# Altium schematic sheet M.2-12V-LED-Regulator-Relay-copy_2024-05-01.schdoc
size 290 x 293 mm
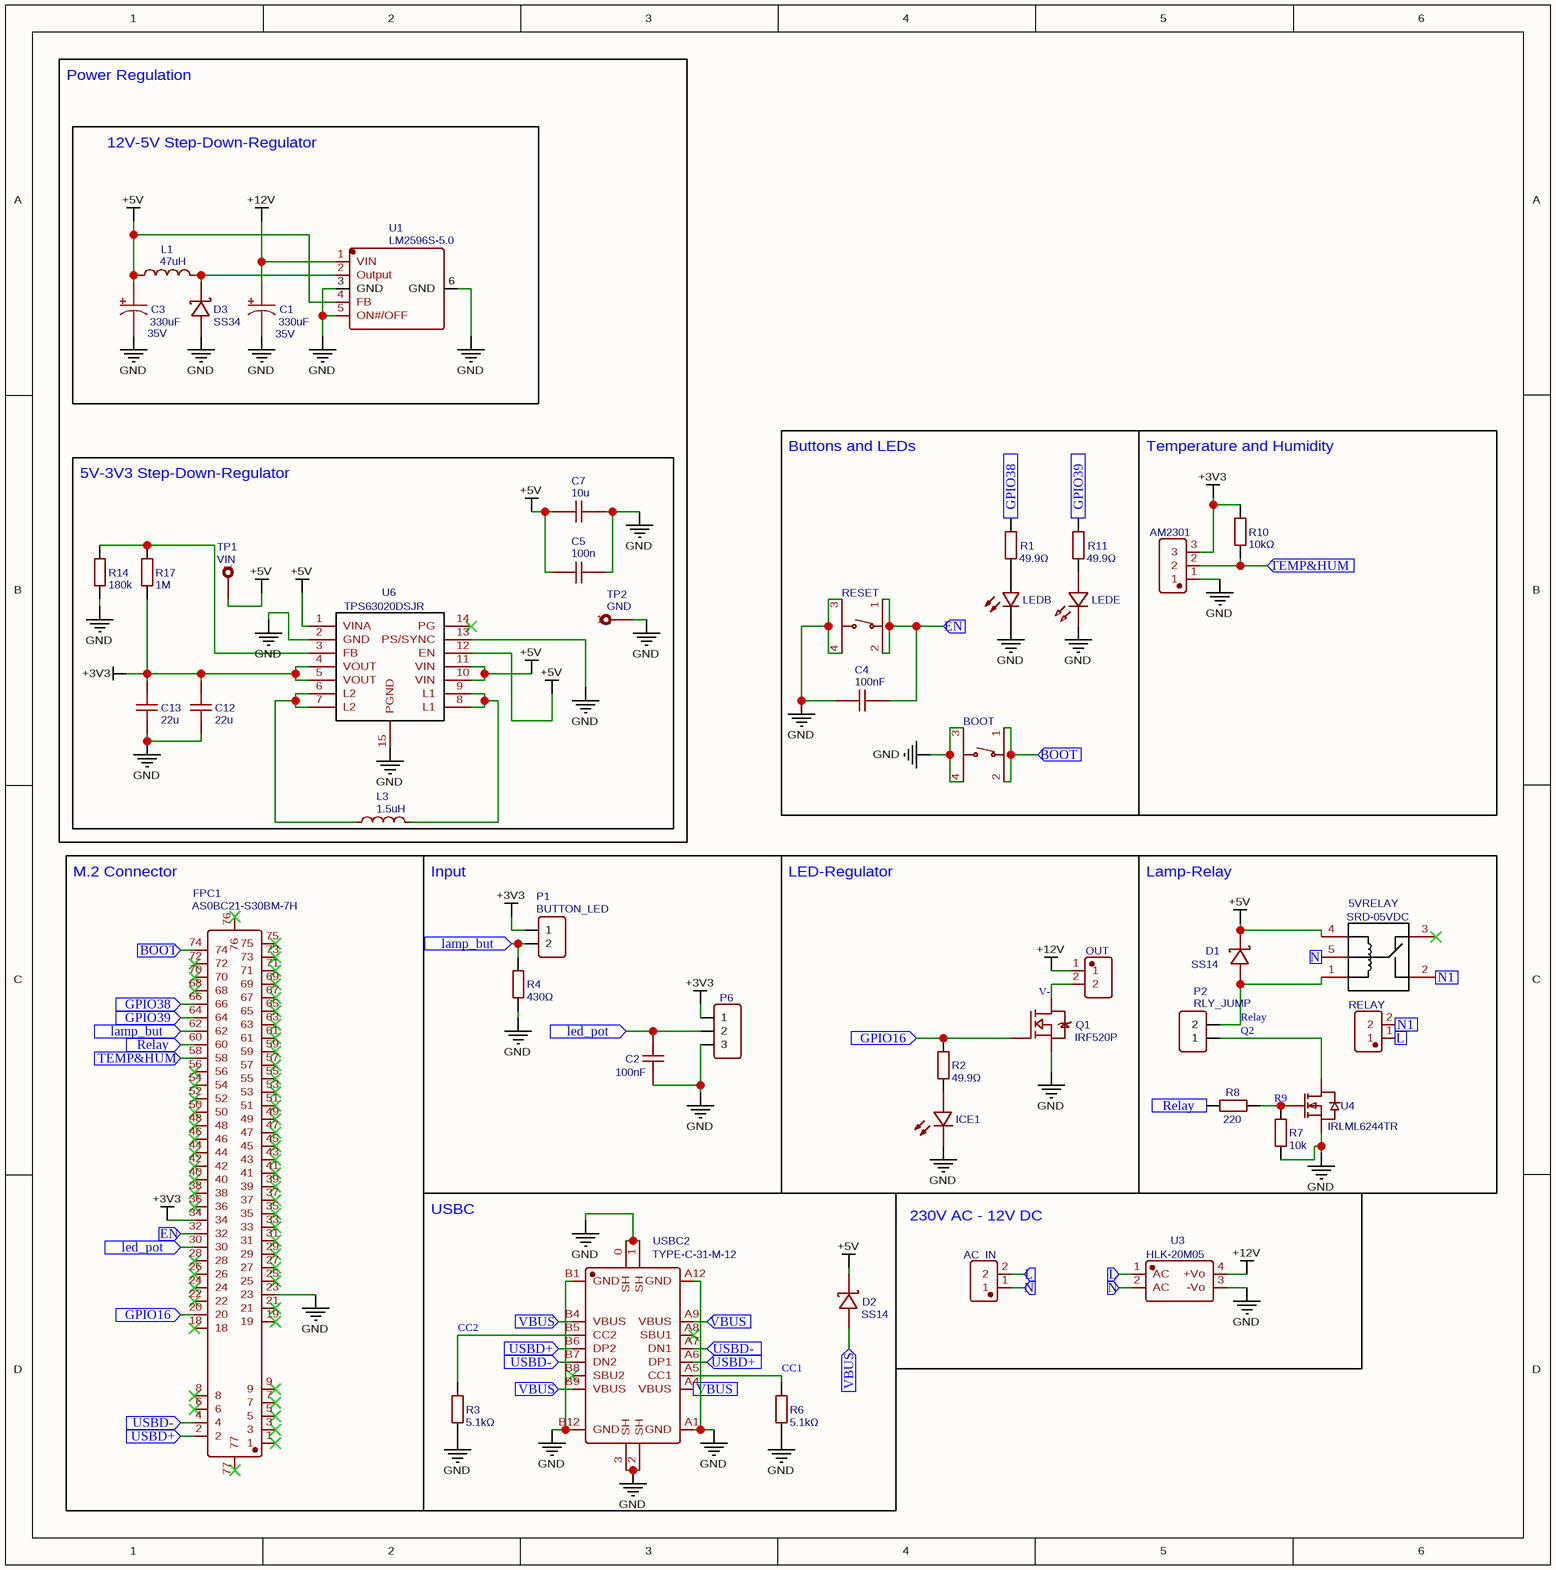
[diagram p0: M.2-12V-LED-Regulator-Relay-copy_2024-05-01.schdoc]

## Parts
5VRELAY  SRD-05VDC  [RELAY-TH_SRD-03VDC-SL-C]
AC_IN  VLT  [CONN-TH_P5.00_KF301-5.0-2P]  (value not drawn)
AM2301  1125  [CONN-TH_1125-1103S0S113CR01]  (value not drawn)
BOOT  TS-1187A-B-A-B  [SW-SMD_4P-L5.1-W5.1-P3.70-LS6.5-TL-2]  (value not drawn)
C1  330uF  [CAP-SMD_BD6.3-L6.6-W6.6-LS7.2-R-RD]
C2  100nF  [C0603]
C3  330uF  [CAP-SMD_BD6.3-L6.6-W6.6-LS7.2-R-RD]
C4  100nF  [C0603]
C5  100n  [C0603]
C7  10u  [C0603]
C12  22u  [C0603]
C13  22u  [C0603]
D1  SS14  [SMA_L4.2-W2.6-LS5.3-RD]
D2  SS14  [SMA_L4.2-W2.6-LS5.3-RD]
D3  SS34  [SMA(DO-214AC)]
FPC1  AS0BC21-S30BM-7H  [CONN-SMD_AS0BC21-S30BM-7H]
ICE1  MHT192WDT-ICE  [LED0603-RD]  (value not drawn)
L1  47uH  [IND-SMD_L12.0-W12.0_CDRH127NP]
L3  1.5uH  [IND-SMD_L7.2-W6.6_GPSR0730]
LEDB  FC-DA1608BK-470H10  [LED0603-RD]  (value not drawn)
LEDE  XL-1608UGC-04  [LED0603-RD_GREEN]  (value not drawn)
OUT  VLT  [CONN-TH_P5.00_KF301-5.0-2P]  (value not drawn)
P1  BUTTON_LED  [HDR-TH_2P-P2.54-V-F]
P2  RLY_JUMP  [HDR-TH_2P-P2.54-V-F]
P6  Header-Female-2.54_1x3  [HDR-TH_3P-P2.54-V-F]  (value not drawn)
Q1  IRF520P  [TO-220-3_L10.0-W4.5-P2.54-T]
R1  49.9Ω  [R0603]
R2  49.9Ω  [R0603]
R3  5.1kΩ  [R0603]
R4  430Ω  [R0603]
R6  5.1kΩ  [R0603]
R7  10k  [R0603]
R8  220  [R0603]
R10  10kΩ  [R0603]
R11  49.9Ω  [R0603]
R14  180k  [R0603]
R17  1M  [R0603]
RELAY  VLT  [CONN-TH_P5.00_KF301-5.0-2P]  (value not drawn)
RESET  TS-1187A-B-A-B  [SW-SMD_4P-L5.1-W5.1-P3.70-LS6.5-TL-2]  (value not drawn)
TP1  VIN  [PKG-TEST-POINT-PTH-1X1]
TP2  GND  [PKG-TEST-POINT-PTH-1X1]
U1  LM2596S-5.0  [TO-263-5_L10.6-W9.6-P1.70-LS15.9-BR]
U3  HLK-20M05  [PWRM-TH_HLK-20MXX]
U4  IRLML6244TR  [SOT-23-3_L2.9-W1.3-P1.90-LS2.4-BR]
U6  TPS63020DSJR  [VSON-14_L4.0-W3.0-P0.50-BL-EP_TI_DSJ]
USBC2  TYPE-C-31-M-12  [USB-C_SMD-TYPE-C-31-M-12]

## Blocks framed on the sheet
12V-5V Step-Down-Regulator: C1 C3 D3 L1 U1
Buttons and LEDs: BOOT C4 LEDB LEDE R1 R11 RESET
Temperature and Humidity: AM2301 R10
5V-3V3 Step-Down-Regulator: C5 C7 C12 C13 L3 R14 R17 TP1 TP2 U6
M.2 Connector: FPC1
Input: C2 P1 P6 R4
LED-Regulator: ICE1 OUT Q1 R2
Lamp-Relay: 5VRELAY D1 P2 R7 R8 RELAY U4
USBC: D2 R3 R6 USBC2
230V AC - 12V DC: AC_IN U3

## Ports
BOOT (in), EN (in), GPIO16 (in), GPIO38 (in), GPIO39 (in), L (in), lamp_but (in), led_pot (in), N1 (in), N (in), Relay (in), TEMP&HUM (in), USBD+ (in), USBD- (in), VBUS (in)

## Nets
+3V3: AM2301.3 C12.2 C13.2 FPC1.34 P1.1 P6.1 R10.2 R17.1 U6.4(VOUT) U6.5(VOUT)
+5V: 5VRELAY.4 C3.1 C5.1 C7.2 D1.1(K) D2.1(K) L1.1 TP1.1 U1.4(FB) U6.1(VINA) U6.10(VIN) U6.11(VIN) U6.12(EN)
+12V: C1.1 OUT.1 U1.1(VIN) U3.4(+Vo)
GND: AM2301.1 BOOT.3(C) BOOT.4(D) C1.2 C2.1 C3.2 C4.1 C5.2 C7.1 C12.1 C13.1 D3.1(A) FPC1.23 ICE1.1(-) LEDB.1(-) LEDE.1(K) P6.3 Q1.3(S) R3.1 R4.1 R6.1 R7.1 R14.1 RESET.3(C) RESET.4(D) TP2.1 U1.3(GND) U1.5(ON#/OFF) U1.6(GND) U3.3(-Vo) U4.2(S) U6.2(GND) U6.13(PS/SYNC) U6.15(PGND) USBC2.0(SH) USBC2.1(SH) USBC2.2(SH) USBC2.3(SH) USBC2.A1(GND) USBC2.A12(GND) USBC2.B1(GND) USBC2.B12(GND)
BOOT: BOOT.1(A) BOOT.2(B) FPC1.74 ; port BOOT
CC1: R6.2 USBC2.A5(CC1)
CC2: R3.2 USBC2.B5(CC2)
EN: C4.2 FPC1.32 RESET.1(A) RESET.2(B) ; port EN
GPIO16: FPC1.20 Q1.1(G) R2.2 ; port GPIO16
GPIO38: FPC1.66 R1.2 ; port GPIO38
GPIO39: FPC1.64 R11.2 ; port GPIO39
L: AC_IN.2 RELAY.1 U3.1(AC) ; port L
lamp_but: FPC1.62 P1.2 R4.2 ; port lamp_but
led_pot: C2.2 FPC1.30 P6.2 ; port led_pot
N: 5VRELAY.5 AC_IN.1 U3.2(AC) ; port N
N1: 5VRELAY.2 RELAY.2 ; port N1
Q2: P2.1 U4.3(D)
R9: R7.2 R8.2 U4.1(G)
Relay: FPC1.60 R8.1 ; port Relay
Relay: 5VRELAY.1 D1.2(A) P2.2  [a separate net that carries the same name]
TEMP&HUM: AM2301.2 FPC1.58 R10.1 ; port TEMP&HUM
USBD+: FPC1.2 USBC2.A6(DP1) USBC2.B6(DP2) ; port USBD+
USBD-: FPC1.4 USBC2.A7(DN1) USBC2.B7(DN2) ; port USBD-
V-: OUT.2 Q1.2(D)
VBUS: D2.2(A) USBC2.A4(VBUS) USBC2.A9(VBUS) USBC2.B4(VBUS) USBC2.B9(VBUS) ; port VBUS
NetD3_2: D3.2(K) L1.2 U1.2(Output)
NetICE1_2: ICE1.2(+) R2.1
NetL3_1: L3.1 U6.6(L2) U6.7(L2)
NetL3_2: L3.2 U6.8(L1) U6.9(L1)
NetLEDB_2: LEDB.2(+) R1.1
NetLEDE_2: LEDE.2(A) R11.1
NetR14_2: R14.2 R17.2 U6.3(FB)

Not connected (* = marked no-connect by the designer): 5VRELAY 3*; FPC1 1* 3* 5* 6* 7* 8* 9* 18* 19* 21* 22* 24* 25* 26* 27* 28* 29* 31* 33* 35* 36* 37* 38* 39* 40* 41* 42* 43* 44* 45* 46* 47* 48* 49* 50* 51* 52* 53* 54* 55* 56* 57* 59* 61* 63* 65* 67* 68* 69* 70* 71* 72* 73* 75* 76* 77*; U6 14(PG)*; USBC2 A8(SBU1)* B8(SBU2)*

## Notes on the sheet
- Power Regulation
- (near C3) 35V
- (near C1) 35V

## Library data of the parts
5VRELAY = SRD-05VDC: Manufacturer: 松乐; Manufacturer Part: SRD-03VDC-SL-C; Contributor: MonicaPaez; Supplier: LCSC; Supplier Part: C496430; JLCPCB Part Class: Extended Part; spicePre: K; spiceSymbolName: SRD-03VDC-SL-C_C496430
AC_IN OUT RELAY = VLT: Manufacturer: Cixi Kefa Elec; Manufacturer Part: KF301-5.0-2P; Contributor: VasilyN; Package Display: No; Supplier: LCSC; Supplier Part: C474881; spicePre: U; spiceSymbolName: KF301-5.0-2P
AM2301 = 1125: Manufacturer: Wcon(维峰电子); Manufacturer Part: 1125-1103S0S113CR01; Contributor: LCSC; Supplier: LCSC; Supplier Part: C721860; JLCPCB Part Class: Extended Part; spicePre: C; spiceSymbolName: 1125-1103S0S113CR01
BOOT RESET = TS-1187A-B-A-B: Manufacturer: XKB Connectivity(中国星坤); Contributor: LCSC; Supplier: LCSC; Supplier Part: C318884; Manufacturer Part: TS-1187A-B-A-B; JLCPCB Part Class: Basic Part; spicePre: S; spiceSymbolName: TS-1187A-B-A-B
C1 C3 = 330uF: Manufacturer: lelon(立隆); Manufacturer Part: VZT331M0JTR-0606ACS; nameAlias: Value; Contributor: LCSC; Supplier: LCSC; Supplier Part: C286137; JLCPCB Part Class: Extended Part; spicePre: C; spiceSymbolName: VZT331M0JTR-0606ACS
C2 C4 = 100nF: Manufacturer: YAGEO(国巨); Manufacturer Part: CC0603KRX7R9BB104; nameAlias: Capacitance; Supplier: LCSC; Supplier Part: C14663; JLCPCB Part Class: Basic Part; spicePre: C; spiceSymbolName: CC0603KRX7R9BB104
C5 = 100n: Manufacturer: YAGEO(国巨); Manufacturer Part: CC0603KRX7R9BB104; nameAlias: Capacitance; Supplier: LCSC; Supplier Part: C14663; JLCPCB Part Class: Basic Part; spicePre: C; spiceSymbolName: CC0603KRX7R9BB104
C7 = 10u: Manufacturer: SAMSUNG(三星); Manufacturer Part: CL10A106KP8NNNC; nameAlias: Capacitance; Supplier: LCSC; Supplier Part: C19702; JLCPCB Part Class: Basic Part; spicePre: C; spiceSymbolName: CL10A106KP8NNNC
C12 C13 = 22u: Manufacturer: SAMSUNG(三星); Manufacturer Part: CL10A226MQ8NRNC; nameAlias: Capacitance; Supplier: LCSC; Supplier Part: C59461; JLCPCB Part Class: Basic Part; spicePre: C; spiceSymbolName: CL10A226MQ8NRNC
D1 D2 = SS14: Manufacturer: MDD; Supplier: LCSC; Manufacturer Part: SS14; Supplier Part: C2480; JLCPCB Part Class: Basic Part; spicePre: D; spiceSymbolName: SS14
D3 = SS34: Manufacturer: Yenji; Contributor: LCSC; SMT Type: Extend; Supplier: LCSC; Manufacturer Part: SS34; Supplier Part: C142458; LCSC Assembly: Yes; spicePre: D
FPC1 = AS0BC21-S30BM-7H: Manufacturer: FOXCONN(富士康); Contributor: LCSC; Supplier: LCSC; Supplier Part: C2832351; Manufacturer Part: AS0BC21-S30BM-7H; JLCPCB Part Class: Extended Part; link: https://lcsc.com/eda_search?q=C2832351&%26type=1&ref=editor; spicePre: F; spiceSymbolName: AS0BC21-S30BM-7H
ICE1 = MHT192WDT-ICE: Manufacturer: MEIHUA(美华); Contributor: LCSC; Supplier: LCSC; Supplier Part: C389522; Manufacturer Part: MHT192WDT-ICE; JLCPCB Part Class: Extended Part; link: https://lcsc.com/eda_search?q=C389522&%26type=1&ref=editor; spicePre: L; spiceSymbolName: MHT192WDT-ICE
L1 = 47uH: Manufacturer: Sumida; Manufacturer Part: CDRH127NP-470MC; nameAlias: Inductance; Contributor: LCSC; Supplier: LCSC; Supplier Part: C167265; spicePre: L; spiceSymbolName: CDRH127NP-470MC
L3 = 1.5uH: Manufacturer: SHOU HAN(首韩); Manufacturer Part: CYA0630-1.5UH; nameAlias: Value; Contributor: lcsc; Supplier: LCSC; Supplier Part: C5189745; JLCPCB Part Class: Extended Part; spicePre: L; spiceSymbolName: CYA0630-1.5UH
LEDB = FC-DA1608BK-470H10: Manufacturer: 国星光电; Manufacturer Part: NCD0603B1; Supplier: LCSC; Supplier Part: C84266; JLCPCB Part Class: Extended Part; link: https://lcsc.com/eda_search?q=C84266&%26type=1&ref=editor; spicePre: L; spiceSymbolName: FC-DA1608BK-470H10
LEDE = XL-1608UGC-04: Manufacturer: XINGLIGHT(成兴光); Contributor: lcsc; Supplier: LCSC; Supplier Part: C965804; Manufacturer Part: XL-1608UGC-04; JLCPCB Part Class: Extended Part; link: https://lcsc.com/eda_search?q=C965804&%26type=1&ref=editor; spicePre: L; spiceSymbolName: XL-1608UGC-04
P1 = BUTTON_LED: Manufacturer: BOOMELE(博穆精密); Manufacturer Part: 2.54-1*2P母; Supplier: LCSC; Supplier Part: C49661; JLCPCB Part Class: Extended Part; spicePre: P; spiceSymbolName: Header-Female-2.54_1x2
P2 = RLY_JUMP: Manufacturer: BOOMELE(博穆精密); Manufacturer Part: 2.54-1*2P母; Supplier: LCSC; Supplier Part: C49661; JLCPCB Part Class: Extended Part; spicePre: P; spiceSymbolName: Header-Female-2.54_1x2
P6 = Header-Female-2.54_1x3: Manufacturer: BOOMELE(博穆精密); Manufacturer Part: 2.54-1*3P母; Supplier Part: C146243; Supplier: LCSC; link: https://datasheet.lcsc.com/szlcsc/Boom-Precision-Elec-2-54mm-1-8P-Straight-Female-header_C27438.pdf; JLCPCB Part Class: Extended Part; spicePre: P; spiceSymbolName: Header-Female-2.54_1x3
Q1 = IRF520P: Manufacturer: VISHAY(威世); Manufacturer Part: IRF520PBF; Supplier: LCSC; Supplier Part: C2597; JLCPCB Part Class: Extended Part; link: https://lcsc.com/eda_search?q=C2597&%26type=1&ref=editor; spicePre: Q; spiceSymbolName: IRF520PBF
R1 R2 R11 = 49.9Ω: Manufacturer: UNI-ROYAL(厚声); Manufacturer Part: 0603WAF499JT5E; nameAlias: Value; Supplier: LCSC; Supplier Part: C23185; JLCPCB Part Class: Basic Part; link: https://lcsc.com/eda_search?q=C23185&%26type=1&ref=editor; spicePre: R; spiceSymbolName: 0603WAF499JT5E
R3 R6 = 5.1kΩ: Manufacturer Part: 0603WAF5101T5E; Manufacturer: UNI-ROYAL(厚声); Resistance (Ohms): 5.1K; nameAlias: Resistance; Supplier: LCSC; Supplier Part: C23186; JLCPCB Part Class: Basic Part; spicePre: R; spiceSymbolName: 0603WAF5101T5E
R4 = 430Ω: Manufacturer: UNI-ROYAL(厚声); Manufacturer Part: 0603WAF4300T5E; nameAlias: Value; Supplier: LCSC; Supplier Part: C23170; JLCPCB Part Class: Basic Part; link: https://lcsc.com/eda_search?q=C23170&%26type=1&ref=editor; spicePre: R; spiceSymbolName: 0603WAF4300T5E
R7 = 10k: Manufacturer: UNI-ROYAL(厚声); Manufacturer Part: 0603WAF1002T5E; nameAlias: Value; Supplier: LCSC; Supplier Part: C25804; JLCPCB Part Class: Basic Part; spicePre: R; spiceSymbolName: 0603WAF1002T5E
R8 = 220: Manufacturer: UNI-ROYAL(厚声); Manufacturer Part: 0603WAF2200T5E; nameAlias: Value; Supplier: LCSC; Supplier Part: C22962; JLCPCB Part Class: Basic Part; spicePre: R; spiceSymbolName: 0603WAF2200T5E
R10 = 10kΩ: Manufacturer: UNI-ROYAL(厚声); Manufacturer Part: 0603WAF1002T5E; nameAlias: Value; Supplier: LCSC; Supplier Part: C25804; JLCPCB Part Class: Basic Part; link: https://lcsc.com/eda_search?q=C25804&%26type=1&ref=editor; spicePre: R; spiceSymbolName: 0603WAF1002T5E
R14 = 180k: Manufacturer: RALEC(旺诠); Manufacturer Part: RTT03184JTP; nameAlias: Value; Supplier: LCSC; Supplier Part: C103362; JLCPCB Part Class: Extended Part; spicePre: R; spiceSymbolName: RTT03184JTP
R17 = 1M: Manufacturer: UNI-ROYAL(厚声); Manufacturer Part: 0603WAF1004T5E; nameAlias: Value; Supplier: LCSC; Supplier Part: C22935; JLCPCB Part Class: Basic Part; spicePre: R; spiceSymbolName: 0603WAF1004T5E
U1 = LM2596S-5.0: Manufacturer: Texas Instruments; Manufacturer Part: LM2596S-5.0/NOPB; Contributor: LCSC; Supplier: LCSC; Supplier Part: C116713; spicePre: U
U3 = HLK-20M05: Manufacturer: HI-LINK(海凌科); Contributor: LCSC; Supplier: LCSC; Supplier Part: C465408; Manufacturer Part: HLK-20M05; JLCPCB Part Class: Extended Part; spicePre: U; spiceSymbolName: HLK-20M05
U4 = IRLML6244TR: Manufacturer: UMW(广东友台半导体); Manufacturer Part: IRLML6244TR(UMW); Contributor: lcsc; Supplier: LCSC; Supplier Part: C5354986; spicePre: U; spiceSymbolName: IRLML6244TR(UMW)
U6 = TPS63020DSJR: Manufacturer: TI(德州仪器); Supplier: LCSC; Manufacturer Part: TPS63020DSJR; Supplier Part: C15483; JLCPCB Part Class: Extended Part; link: https://lcsc.com/eda_search?q=C15483&%26type=1&ref=editor; spicePre: U; spiceSymbolName: TPS63020DSJR
USBC2 = TYPE-C-31-M-12: Manufacturer: 韩国韩荣; Contributor: LCSC; Supplier: LCSC; Supplier Part: C165948; Manufacturer Part: TYPE-C-31-M-12; JLCPCB Part Class: Extended Part; spicePre: U; spiceSymbolName: TYPE-C-31-M-12
TP1 = VIN: spicePre: T; spiceSymbolName: TEST-POINT-PTH-1X1
TP2 = GND: spicePre: T; spiceSymbolName: TEST-POINT-PTH-1X1